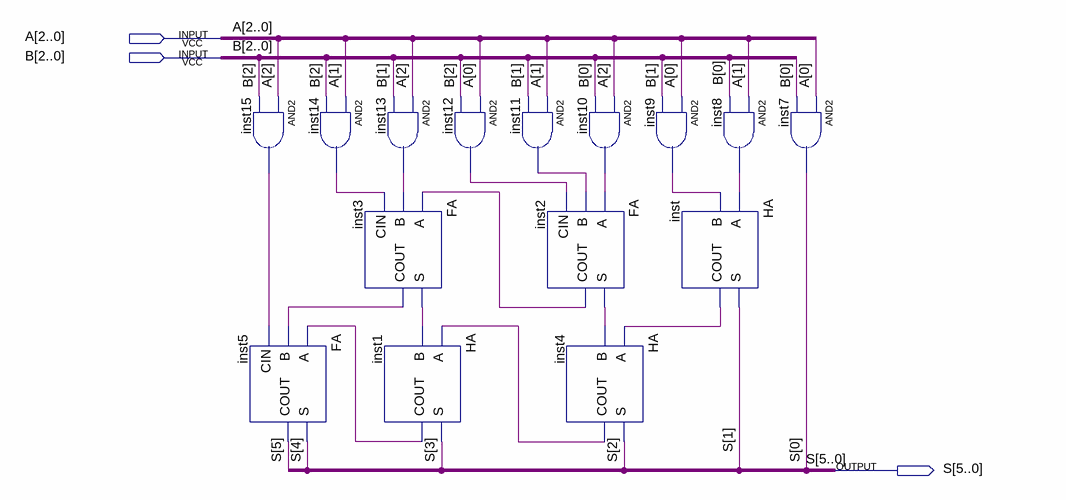
[diagram p0: schematic sheet]
// Quartus schematic NHAN3BIT.bdf as structural Verilog: 15 symbols, 3 pins
module NHAN3BIT (
  input  [2:0] A,
  input  [2:0] B,
  output [5:0] S
);

  wire inst1_cout, inst2_cout, inst2_s, inst3_cout, inst3_s, inst4_cout, inst8_out, inst9_out, inst10_out,
       inst11_out, inst12_out, inst13_out, inst14_out, inst15_out, inst_cout;

  and inst15 (inst15_out, A[2], B[2]);
  FA inst5 (.A(inst1_cout), .B(inst3_cout), .CIN(inst15_out), .S(S[4]), .COUT(S[5]));
  and inst13 (inst13_out, A[2], B[1]);
  and inst14 (inst14_out, A[1], B[2]);
  FA inst3 (.A(inst2_cout), .B(inst13_out), .CIN(inst14_out), .S(inst3_s), .COUT(inst3_cout));
  HA inst1 (.A(inst4_cout), .B(inst3_s), .S(S[3]), .COUT(inst1_cout));
  and inst12 (inst12_out, A[0], B[2]);
  and inst11 (inst11_out, A[1], B[1]);
  FA inst2 (.A(inst10_out), .B(inst11_out), .CIN(inst12_out), .S(inst2_s), .COUT(inst2_cout));
  and inst10 (inst10_out, A[2], B[0]);
  HA inst4 (.A(inst_cout), .B(inst2_s), .S(S[2]), .COUT(inst4_cout));
  and inst9 (inst9_out, A[0], B[1]);
  HA inst (.A(inst8_out), .B(inst9_out), .S(S[1]), .COUT(inst_cout));
  and inst8 (inst8_out, A[1], B[0]);
  and inst7 (S[0], A[0], B[0]);
endmodule
